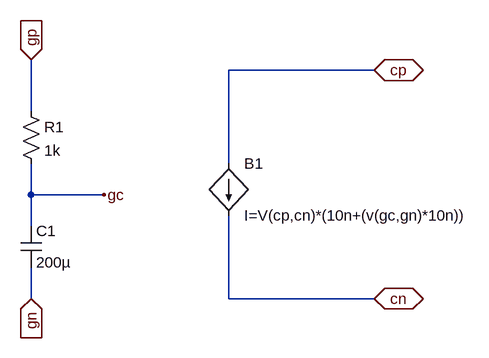
[diagram p0: schematic capteur.asc]
capteur.asc, the LTspice schematic file:
Version 4
SHEET 1 880 680
WIRE 640 16 416 16
WIRE 112 80 112 0
WIRE 416 160 416 16
WIRE 112 208 112 160
WIRE 224 208 112 208
WIRE 112 256 112 208
WIRE 112 368 112 320
WIRE 416 368 416 240
WIRE 640 368 416 368
FLAG 224 208 gc
FLAG 640 16 cp
IOPIN 640 16 BiDir
FLAG 640 368 cn
IOPIN 640 368 BiDir
FLAG 112 0 gp
IOPIN 112 0 In
FLAG 112 368 gn
IOPIN 112 368 In
SYMBOL res 96 64 R0
SYMATTR InstName R1
SYMATTR Value 1k
SYMBOL cap 96 256 R0
SYMATTR InstName C1
SYMATTR Value 200µ
SYMBOL bi 416 160 R0
SYMATTR InstName B1
SYMATTR Value I=V(cp,cn)*(10n+(v(gc,gn)*10n))

The netlist it stands for:
* capteur.asc
R1 gp gc 1k
C1 gc gn 200µ
B1 cp cn I=V(cp,cn)*(10n+(v(gc,gn)*10n))
.backanno
.end